# Altium schematic sheet LED_driver.SchDoc: LED Driver
size A4; Author: Gerald Ebmer; DrawnBy: Gerald Ebmer; Engineer: Gerald Ebmer; Revision: 1.1; SheetNumber: 1; SheetTotal: 6; PageSetup: Record=PageOptions|CenterHorizontal=True|CenterVertical=True|PrintScale=1.00|XCorrection=1.00|YCorrection=1.00|PrintKind=0|BorderSize=5000000|LeftOffset=0|BottomOffset=0|Orientation=2|PaperLength=1000|PaperWidth=1000|Scale=100|PaperSource=7|PrintQuality=-3|MediaType=1|DitherType=10|PrintScaleMode=1|PaperKind=A4|PaperIndex=9; Time: 3
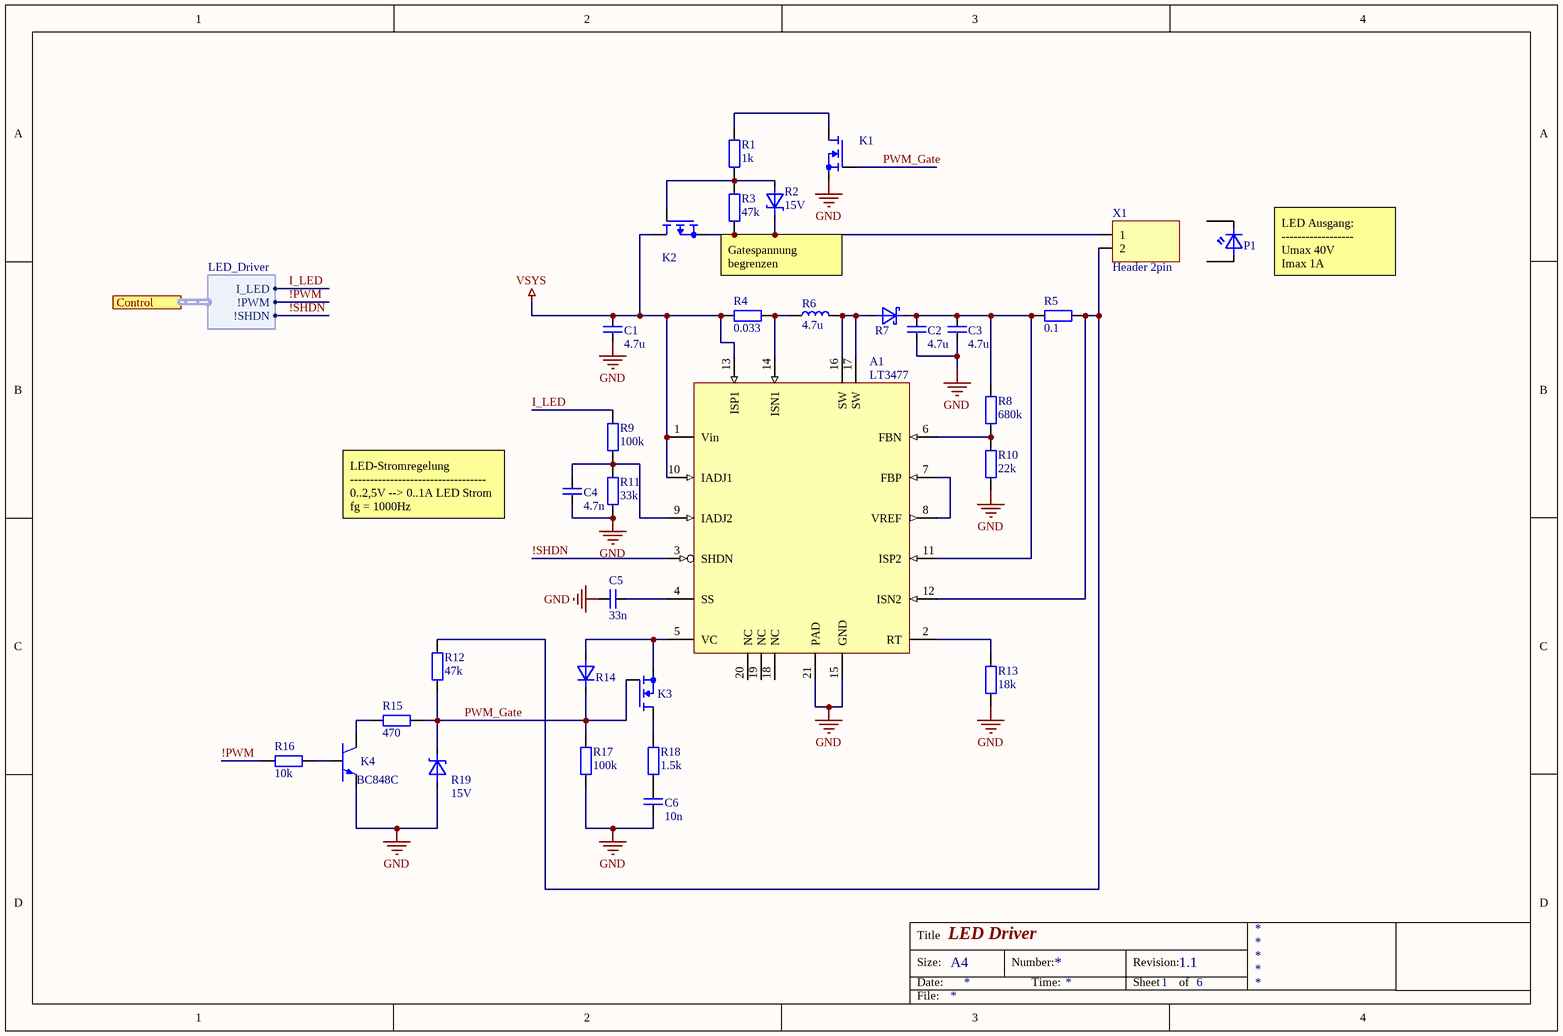
[diagram p0: LED_driver.SchDoc]

## Parts
A1  LT3477  [TSSOP20 exposed pad]
C1  4.7u  [1210]
C2  4.7u  [1210]
C3  4.7u  [1210]
C4  4.7n  [0805]
C5  33n  [0805]
C6  10n  [0805]
K1  MOSFET N-channel enh  [SOT23-3]  (value not drawn)
K2  pmos FDC658  [SuperSOT-6]  (value not drawn)
K3  MOSFET N-channel enh  [SOT23-3]  (value not drawn)
K4  BC848C  [SOT23-3]
P1  LED  (value not drawn)
R1  1k  [0805]
R2  15V  [SOD523]
R3  47k  [0805]
R4  0.033  [2512]
R5  0.1  [2512]
R6  4.7u  [SMD_Ind_5x5]
R7  Diode shottky  [PowerDI123]  (value not drawn)
R8  680k  [0805]
R9  100k  [0805]
R10  22k  [0805]
R11  33k  [0805]
R12  47k  [0805]
R13  18k  [0805]
R14  1N4148W  [SOD123F]  (value not drawn)
R15  470  [0805]
R16  10k  [0805]
R17  100k  [0805]
R18  1.5k  [0805]
R19  15V  [SOD523]
X1  Header 2pin  [PHOENIX_1729128]

## Ports
Control (harness LED_Driver)

## Harnesses
LED_Driver: I_LED, !PWM, !SHDN

## Nets
GND: A1.15(GND) A1.21(PAD) C1.1 C2.1 C3.1 C4.2 C5.2 C6.1 K1.2(Source) K4.2(Emitter) R10.1 R11.1 R13.1 R17.1 R19.2(Annode)
VSYS: A1.1(Vin) A1.10(IADJ1) A1.13(ISP1) C1.2 K2.1(Drain) R4.1
!PWM: R16.1 ; port Control.!PWM
!SHDN: A1.3(SHDN) ; port Control.!SHDN
I_LED: R9.2 ; port Control.I_LED
PWM_Gate: K1.3(Gate) K3.3(Gate) R12.2 R14.1(Kathode) R15.2 R17.2 R19.1(Kathode)
NetA1_2: A1.2(RT) R13.2
NetA1_4: A1.4(SS) C5.1
NetA1_5: A1.5(VC) K3.2(Source) R14.2(Annode)
NetA1_6: A1.6(FBN) R8.1 R10.2
NetA1_7: A1.7(FBP) A1.8(VREF)
NetA1_9: A1.9(IADJ2) C4.1 R9.1 R11.2
NetA1_11: A1.11(ISP2) C2.2 C3.2 R5.1 R7.1(Kathode) R8.2
NetA1_12: A1.12(ISN2) R5.2 R12.1 X1.2
NetA1_14: A1.14(ISN1) R4.2 R6.1
NetA1_16: A1.16(SW) A1.17(SW) R6.2 R7.2(Annode)
NetC6_2: C6.2 R18.1
NetK1_1: K1.1(Drain) R1.2
NetK2_2: K2.2(Source) R2.1(Kathode) R3.1 X1.1
NetK2_3: K2.3(Gate) R1.1 R2.2(Annode) R3.2
NetK3_1: K3.1(Drain) R18.2
NetK4_1: K4.1(Collector) R15.1
NetK4_3: K4.3(Basis) R16.2

Not connected (* = marked no-connect by the designer): A1 18(NC) 19(NC) 20(NC); P1 1(Kathode) 2(Annode)

## Notes on the sheet
- Gatespannung begrenzen
- (near P1) LED Ausgang:
  ------------------
  Umax 40V
  Imax 1A
- LED-Stromregelung
  ----------------------------------
  0..2,5V --> 0..1A LED Strom
  fg = 1000Hz
- Title
- Size:
- Date:
- A4
- Number:
- Time:
- Revision:
- Sheet
- of
- File:

## Library data of the parts
A1 = LT3477: 3A, DC/DC Converter with Dual Rail-to-Rail Current Sense; Bauform: *; Bestell-Nr.: *; Bezeichnung: *; Hersteller: *; Lieferant: *; Preis: *
C1-C3 = Kondensator: Bezeichnung: C1210C475K5RACTU; Hersteller: KEMET; Lieferant: RS Components; Bestell-Nr.: 691-1265; Bauform: *; Preis: *
C4 C5 = Kondensator: Bezeichnung: C2012C0G1E333J125AA; Hersteller: TDK; Lieferant: RS Components; Bestell-Nr.: 915-9249; Bauform: *; Preis: *
C6 = Kondensator: Bezeichnung: C0805C103M5RACTU; Hersteller: Kemet; Lieferant: Farnell; Bestell-Nr.: 2581081; Bauform: 0805
K1 K3 = MOSFET N-channel enh: Bezeichnung: 2N7002; Lieferant: RS Components; Hersteller: Fairchild Semiconductor; Bestell-Nr.: 671-0312; Preis: *; Bauform: *
K2 = MOSFET P-channel enh: Bezeichnung: FDC658P; Lieferant: RS Components; Hersteller: Fairchild; Bestell-Nr.: 671-0359; Bauform: SuperSOT-6
K4 = Transistor NPN: Lieferant: RS Components; Hersteller: Infineon; Bestell-Nr.: 445-2039; Bezeichnung: BC848C; Preis: *; Bauform: *
R1 = Widerstand: Bezeichnung: MCWR08X1001FTL; Lieferant: Farnell; Bestell-Nr.: 2447587; Hersteller: MULTICOMP; Bauform: 0805; Preis: *
R2 R19 = Diode zener: Bezeichnung: MM5Z15V; Lieferant: RS Components; Hersteller: Fairchild Semiconductor; Bestell-Nr.: 802-3004; Preis: *; Bauform: *
R3 R12 = Widerstand: Bezeichnung: MCWR08X4702FTL; Lieferant: Farnell; Bestell-Nr.: 2447664; Hersteller: MULTICOMP; Bauform: 0805
R4 = Widerstand: Bezeichnung: TLM3ADR033FTE; Lieferant: RS Components; Bestell-Nr.: 869-5505; Hersteller: TE Connectivity; Bauform: *; Preis: *
R5 = Widerstand: Bezeichnung: RL73K3AR10J; Lieferant: RS Components; Bestell-Nr.: 223-0972; Hersteller: TE Connectivity; Bauform: *; Preis: *
R6 = Induktivität: Bezeichnung: 744316470; Lieferant: RS Components; Bestell-Nr.: 863-1075; Hersteller: Würth; Bauform: *
R7 = Diode shottky: Bezeichnung: DFLS240L-7; Lieferant: RS Components; Hersteller: DiodesZetex; Bestell-Nr.: 708-2337; Preis: *; Bauform: *
R8 = Widerstand: Bezeichnung: MCWR08X6803FTL; Lieferant: Farnell; Bestell-Nr.: 2447704; Hersteller: C; Bauform: 0805; Preis: *
R9 R17 = Widerstand: Bezeichnung: MCWR08X1003FTL; Lieferant: Farnell; Bestell-Nr.: 2447551; Hersteller: MULTICOMP; Bauform: 0805; Preis: *
R10 = Widerstand: Bezeichnung: MCWR08X2202FTL; Lieferant: Farnell; Bestell-Nr.: 2447607; Hersteller: MULTICOMP; Bauform: 0805; Preis: *
R11 = Widerstand: Bezeichnung: MCWR08X3302FTL; Lieferant: Farnell; Bestell-Nr.: 2447639; Hersteller: MULTICOMP; Bauform: 0805; Preis: *
R13 = Widerstand: Bezeichnung: MCWR08X1802FTL; Lieferant: Farnell; Bestell-Nr.: 2447584; Hersteller: MULTICOMP; Bauform: 0805; Preis: *
R14 = Diode: Bezeichnung: 1N4148W-7-F.; Lieferant: Farnell; Hersteller: Diodes Inc; Bestell-Nr.: 1776392; Preis: *; Bauform: *
R15 = Widerstand: Bezeichnung: MCWR08X4700FTL; Lieferant: Farnell; Bestell-Nr.: 2447662; Hersteller: MULTICOMP; Bauform: 0805; Preis: *
R16 = Widerstand: Bezeichnung: MCWR08X1002FTL; Lieferant: Farnell; Bestell-Nr.: 2447553; Hersteller: MULTICOMP; Bauform: 0805; Preis: *
R18 = Widerstand: Bezeichnung: MCWR08X1501FTL; Lieferant: Farnell; Bestell-Nr.: 2447592; Hersteller: MULTICOMP; Bauform: 0805; Preis: *
X1 = Header 2pin: Hersteller: Phoenix Contact; Lieferant: RS Components; Bezeichnung: 1729128; Bestell-Nr.: 193-0586; Bauform: *; Preis: *
P1 = LED: Bezeichnung: *; Preis: *; Bauform: *; Lieferant: *; Hersteller: *; Bestell-Nr.: *